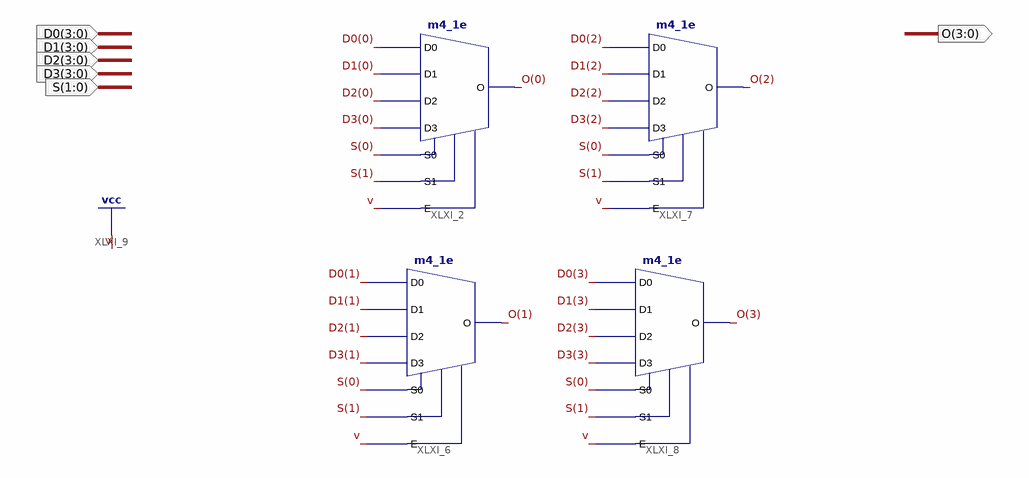
[diagram p0: schematic sheet 1]
// Xilinx ISE schematic mux4x4.sch (spartan3e) as structural Verilog: 4 symbols, 6 ports
module mux4x4 (
  input  [3:0] D0,
  input  [3:0] D1,
  input  [3:0] D2,
  input  [3:0] D3,
  input  [1:0] S,
  output [3:0] O
);

  m4_1e XLXI_2 (.D0(D0[0]), .D1(D1[0]), .D2(D2[0]), .D3(D3[0]), .E(1'b1), .S0(S[0]), .S1(S[1]), .O(O[0]));
  m4_1e XLXI_6 (.D0(D0[1]), .D1(D1[1]), .D2(D2[1]), .D3(D3[1]), .E(1'b1), .S0(S[0]), .S1(S[1]), .O(O[1]));
  m4_1e XLXI_7 (.D0(D0[2]), .D1(D1[2]), .D2(D2[2]), .D3(D3[2]), .E(1'b1), .S0(S[0]), .S1(S[1]), .O(O[2]));
  m4_1e XLXI_8 (.D0(D0[3]), .D1(D1[3]), .D2(D2[3]), .D3(D3[3]), .E(1'b1), .S0(S[0]), .S1(S[1]), .O(O[3]));
endmodule
